# Altium schematic sheet Key.SchDoc
size A
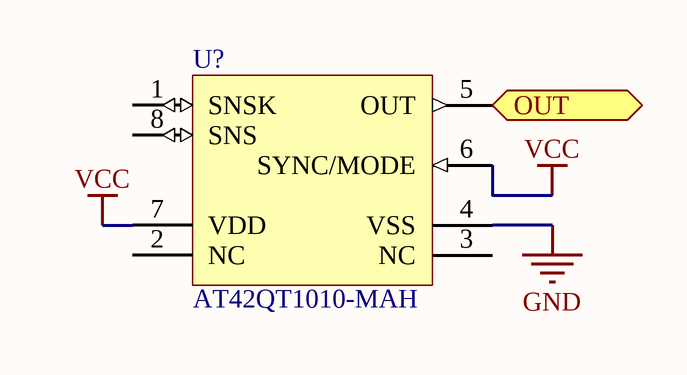
[diagram p0: Key.SchDoc]

## Parts
U?  AT42QT1010-MAH  [8MA4]

## Ports
OUT (out)

## Nets
GND: U?.4(VSS)
VCC: U?.6(SYNC/MODE) U?.7(VDD)
OUT: U?.5(OUT) ; port OUT

Not connected (* = marked no-connect by the designer): U? 1(SNSK) 2(NC) 3(NC) 8(SNS)

## Library data of the parts
U? = CMP-0073-00034-1: One-channel Touch Sensor IC with Reset Timer, -40° to +85° C, 8-pin UDFN/USON; ComponentLink1URL: http://www.atmel.com/; ComponentLink1Description: Manufacturer URL; Code_JEDEC: MO-236/MO-252; DatasheetVersion: revH, May-2010; PackageReference: 8MA4; ComponentLink2Description: Datasheet; PackageVersion: revA, Dec-2009; ComponentLink2URL: http://www.atmel.com/Images/doc9541.pdf; PackageDescription: 8-Pad Plastic Dual Flat No Lead Package (UDFN/USON) Sawn,  2x2x0.6mm Body, 0.5mm Pitch, 0.9x1.5mm Exposed Pad